# Altium schematic sheet battery.SchDoc
size A4
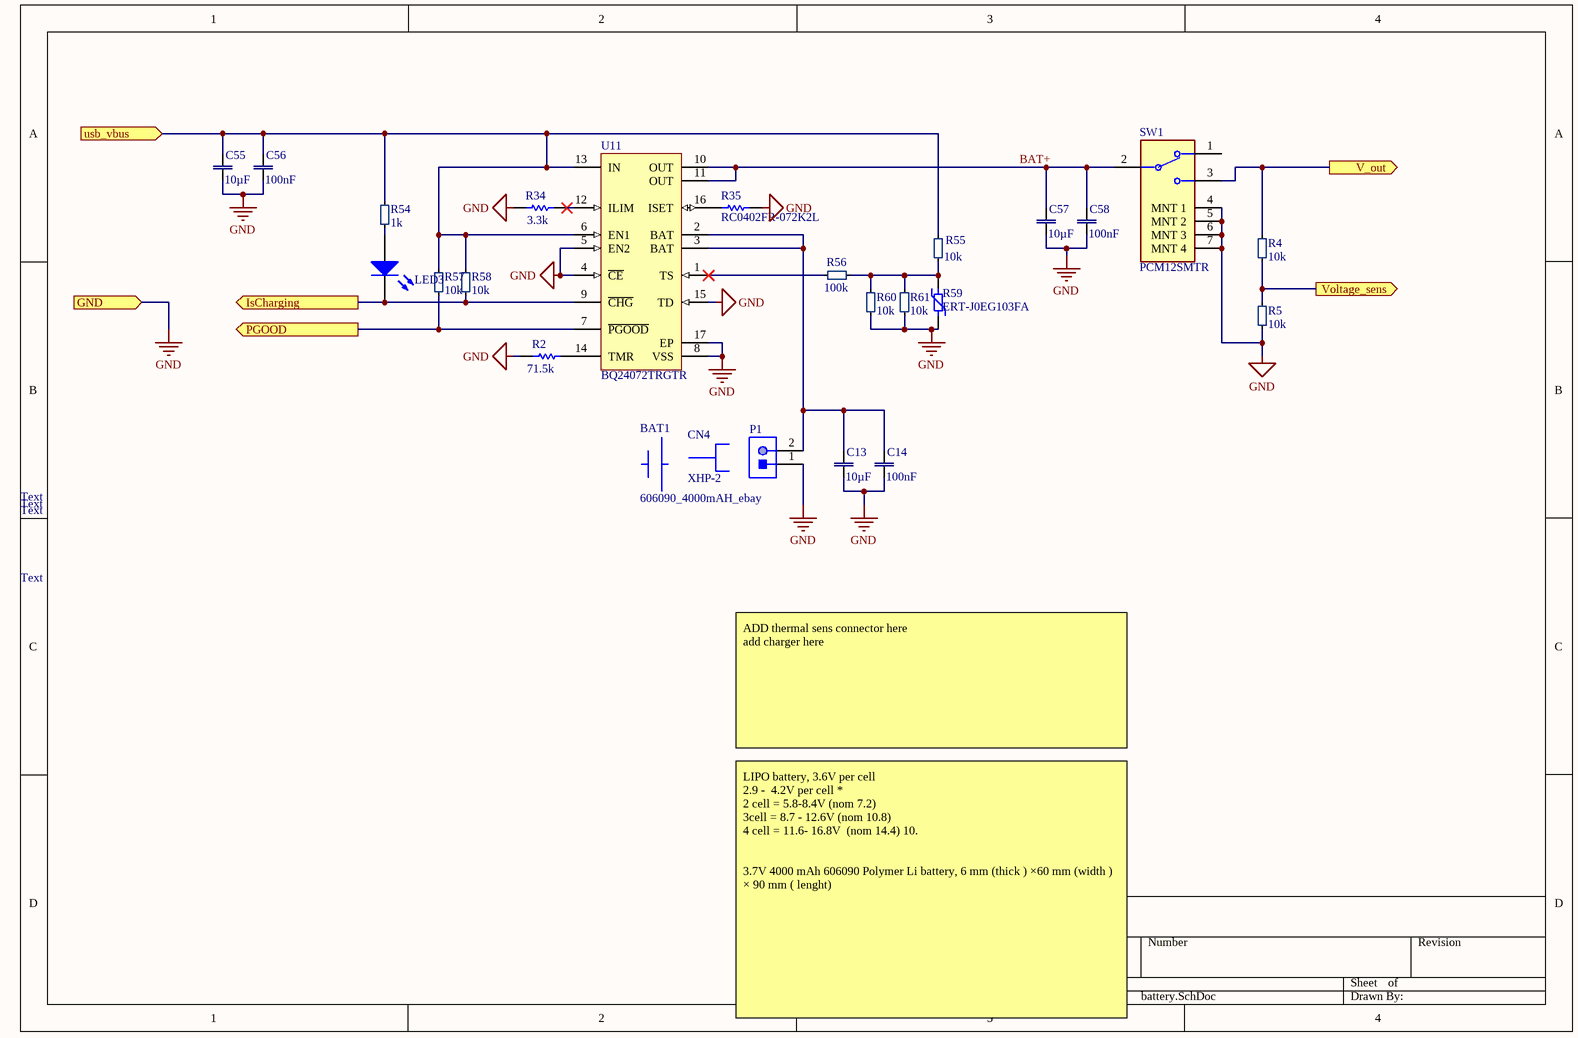
[diagram p0: battery.SchDoc]

## Parts
BAT1  606090_4000mAH_ebay  (mechanical)
C13  Capacitance: 10µF  [Chip2PinSM127P600-8N]  (hidden comment: CL31A106MBHNNNE)
C14  Capacitance: 100nF  [cap0402]  (hidden comment: GRM155R71H104ME14D)
C55  Capacitance: 10µF  [Chip2PinSM127P600-8N]  (hidden comment: CL31A106MBHNNNE)
C56  Capacitance: 100nF  [cap0402]  (hidden comment: GRM155R71H104ME14D)
C57  Capacitance: 10µF  [Chip2PinSM127P600-8N]  (hidden comment: CL31A106MBHNNNE)
C58  Capacitance: 100nF  [cap0402]  (hidden comment: GRM155R71H104ME14D)
CN4  XHP-2  (mechanical)
LED3  150080BS75000  [0805_A]  (value not drawn)
P1  S2B-XH-A(LF)(SN)  [JST-S2B-XH-A(LF)(SN)_V]  (value not drawn)
R2  Resistance: 71.5k  [RESC0402(1005)_N]  (hidden comment: RC0402FR-0771K5L)
R4  Resistance: 10k  [SMD_0402(1005)_M]  (hidden comment: RC0402FR-0710KL)
R5  Resistance: 10k  [SMD_0402(1005)_M]  (hidden comment: RC0402FR-0710KL)
R34  Resistance: 3.3k  [RESC1005X04N]  (hidden comment: RC0402FR-073K3L)
R35  RC0402FR-072K2L  [RESC1005X40X25NL05T10]
R54  Resistance: 1k  [SMD_0402(1005)_M]  (hidden comment: RC0402FR-071KL)
R55  Resistance: 10k  [SMD_0402(1005)_M]  (hidden comment: RC0402FR-0710KL)
R56  Resistance: 100k  [SMD_0402(1005)_M]  (hidden comment: RC0402FR-07100KL)
R57  Resistance: 10k  [SMD_0402(1005)_M]  (hidden comment: RC0402FR-0710KL)
R58  Resistance: 10k  [SMD_0402(1005)_M]  (hidden comment: RC0402FR-0710KL)
R59  ERT-J0EG103FA  [RESC0402(1005)_N]
R60  Resistance: 10k  [SMD_0402(1005)_M]  (hidden comment: RC0402FR-0710KL)
R61  Resistance: 10k  [SMD_0402(1005)_M]  (hidden comment: RC0402FR-0710KL)
SW1  PCM12SMTR  [FP-PCM12SMTR-MFG]
U11  BQ24072TRGTR  [RGT0016C_V]

## Ports
GND (in), IsCharging (out), PGOOD (out), usb_vbus (in), V_out (out), Voltage_sens (out)

## Nets
GND: C13.1 C14.1 C55.1 C56.1 C57.1 C58.1 P1.1 R2.1 R5.1 R34.1 R35.2 R59.1 R60.1 R61.1 SW1.4(MNT_1) SW1.5(MNT_2) SW1.6(MNT_3) SW1.7(MNT_4) U11.4(~{CE}) U11.5(EN2) U11.8(VSS) U11.15(TD) U11.17(EP) ; port GND
BAT+: C57.2 C58.2 SW1.2 U11.10(OUT) U11.11(OUT)
IsCharging: LED3.1(K) R58.1 U11.9(~{CHG}) ; port IsCharging
PGOOD: R57.1 U11.7(~{PGOOD}) ; port PGOOD
usb_vbus: C55.2 C56.2 R54.1 R55.2 R57.2 R58.2 U11.6(EN1) U11.13(IN) ; port usb_vbus
V_out: R4.2 SW1.3 ; port V_out
Voltage_sens: R4.1 R5.2 ; port Voltage_sens
NetC13_2: C13.2 C14.2 P1.2 U11.2(BAT) U11.3(BAT)
NetLED3_2: LED3.2(A) R54.2
NetR2_2: R2.2 U11.14(TMR)
NetR34_2: R34.2 U11.12(ILIM)
NetR35_1: R35.1 U11.16(ISET)
NetR55_1: R55.1 R56.2 R59.2 R60.2 R61.2
NetR56_1: R56.1 U11.1(TS)

Not connected (* = marked no-connect by the designer): SW1 1

## Notes on the sheet
- Text
- ADD thermal sens connector here
  add charger here
- LIPO battery, 3.6V per cell
  2.9 -  4.2V per cell *
  2 cell = 5.8-8.4V (nom 7.2)
  3cell = 8.7 - 12.6V (nom 10.8)
  4 cell = 11.6- 16.8V  (nom 14.4) 10.
  3.7V 4000 mAh 606090 Polymer Li battery, 6 mm (thick ) ×60 mm (width ) × 90 mm ( lenght)

## Library data of the parts
BAT1 = CMP-ROOT-00019-6: https://www.ebay.com/itm/3-7V-4000-mAh-606090-Polymer-Li-battery-Li-po-For-PDA-GPS-DVD-ipod-Tablet-PC/182107148013; Voltage: 3.7V; Mount: connector; RoHS: Yes; Capacity: 4000mAh; ComponentLink1URL: https://www.ebay.com/itm/3-7V-4000-mAh-606090-Polymer-Li-battery-Li-po-For-PDA-GPS-DVD-ipod-Tablet-PC/182107148013; ComponentLink1Description: EBAY; Type: lipo; Case/Package: 606090
C13 C55 C57 = CMP-0001-00015-3: CAP CER 10UF 50V X5R 1206; Capacitor Type: Ceramic; Tolerance: 20%; Thickness: 0.071inch; Mount: Surface Mount; Dielectric: X5R; Length: 0.126inch; Case/Package: 1206; Width: 0.063inch; Voltage Rating (DC): 50V; Max Operating Temperature: 85°C; Case Code (Imperial): 1206; Voltage Rating: 50V; Min Operating Temperature: -55°C; Packaging: Tape and Reel; Case Code (Metric): 3216; RoHS: Yes
C14 C56 C58 = CMP-0001-00001-8: 0402 0.1 uF 50 V ±20% Tolerance X7R SMT Monolithic Ceramic Chip Capacitor; Value: 100nF; Voltage Rating: 50V; Length: 0.039inch; Packaging: Cut Tape; Max Operating Temperature: 125°C; Min Operating Temperature: -55°C; Mount: Surface Mount; Case/Package: 0402; Tolerance: 20%; Width: 0.02inch; Capacitor Type: Ceramic; Thickness: 0.022inch; Pins: 2; RoHS: Yes
CN4 = CMP-ROOT-00022-2: Conn Housing PL 2 POS 2.5mm Crimp ST Cable Mount Bag; Max Voltage Rating (AC): 250V; Wire/Cable Gauge: 22AWG; Max Current Rating: 3A; Gender: Receptacle; Number of Contacts: 2; System: Connector; Contact Resistance: 10mR; Wire Gauge (Max): 30AWG; Insulation Resistance: 1GR; Connector Type: Receptacle,Socket; Mount: Free Hanging,Cable; Height: 0.25inch; Weight: 0.0625lb; Current Rating: 3A; Max Voltage Rating (DC): 250V; Packaging: Bag; REACH SVHC: No SVHC; Lead Pitch: 2.5mm; Width: 5.7mm; Color: Natural; Length: 7.3mm; Housing Material: Polyamide; Number of Rows: 1; Max Operating Temperature: 85°C; Lead Free: Lead Free; Termination: Crimp; Housing Color: White; Depth: 7.75mm; Voltage Rating (AC): 250V; Min Operating Temperature: -25°C; Wire Gauge (Min): 22AWG; Orientation: Straight; Number of Positions: 2; RoHS: Yes; Contact Material: Bronze,Tin; Pitch: 2.5mm
LED3 = CMP-00002-1: SMD LED blue 3.5 V 0805, 150080BS75000, Würth Elektronik; Dominant Wavelength: 470nm; Luminous Intensity: 145mcd; Lens Style: Clear,Rectangular; Forward Current: 30mA; Test Current: 20mA; Forward Voltage: 3.2V; Viewing Angle: 140°; Length: 2mm; Width: 1.25mm; RoHS: Yes; Height: 0.7mm; Color: Blue; Packaging: Tape and Reel; REACH SVHC: Unknown; Max Operating Temperature: 85°C; Case Code (Imperial): 0805; Lead Free: Lead Free; Case Code (Metric): 2012; Case/Package: 0805; Min Operating Temperature: -40°C; Wavelength: 470nm; Package Quantity: 4000; Mount: Surface Mount
P1 = CMP-ROOT-00028-1: XH Series 2.5mm 2 Position Through Hole Shrouded Header Connector; Number of Positions: 2; RoHS: Yes; System: Connector; Mount: Through Hole
R2 = CMP-001-0022-2: RES SMD 71.5K OHM 1% 1/16W 0402; Temperature Coefficient: 100ppm/°C; Voltage Rating: 50V; Max Power Dissipation: 63mW; Power Rating: 62.5mW; Military Standard: Not; Width: 0.02inch; Packaging: Tape and Reel; Case/Package: 0402; Lead Free: Lead Free; Depth: 0.5mm; Termination: SMD/SMT; Value: 71.5k; Number of Terminations: 2; RoHS: Yes; Resistor Type: Thick Film; Length: 0.039inch; Min Operating Temperature: -55°C; Case Code (Metric): 1005; Tolerance: 1%; Mount: SMD; Case Code (Imperial): 0402; Max Operating Temperature: 155°C; Voltage Rating (DC): 50V; Height: 0.016inch; Features: Moisture Resistant
R4 R5 R55 R57 R58 R60 R61 = CMP-008-0005-9: Surface Mount Thick Film Resistor, Rc Series, 10 Kohm, 62.5 Mw, - 1%, 50 V, 0402 [1005 Metric]; Voltage Rating (DC): 50V; Value: 10k; Temperature Coefficient: 100ppm/°C; Power Rating: 62.5mW; Lead Pitch: 0.2mm; Composition: Thick Film; Number of Terminations: 2; Number of Pins: 2; Military Standard: Not; Working Voltage: 50V; Length: 1mm; Packaging: Tape and Reel; Height: 0.32mm; Voltage Rating: 50V; Mount: SMD; Tolerance: 1%; Termination: SMD/SMT; Depth: 0.5mm; Min Operating Temperature: -55°C; RoHS: Yes; Case Code (Metric): 1005; Case Code (Imperial): 0402; Lead Free: Lead Free; Width: 0.5mm; Case/Package: 0402; REACH SVHC: No SVHC; Max Operating Temperature: 155°C
R34 = CMP-001-0021-2: YAGEO (PHYCOMP)         RC0402FR-073K3L             SMD Chip Resistor, Thick Film, 3.3 kohm, 50 V, 0402 [1005 Metric], 63 mW,  1%; Voltage Rating (DC): 50V; Value: 3.3k; Temperature Coefficient: 100ppm/°C; Power Rating: 62.5mW; Max Power Dissipation: 63mW; Packaging: Tape and Reel; Width: 0.5mm; Number of Pins: 2; Height: 0.016inch; Case Code (Imperial): 0402; Case/Package: 0402; Length: 1mm; Tolerance: 1%; Termination: SMD/SMT; Military Standard: Not; RoHS: Yes; Case Code (Metric): 1005; Depth: 0.5mm; Lead Free: Lead Free; Mount: SMD; REACH SVHC: No SVHC; Features: Moisture Resistant; Number of Terminations: 2; Package Quantity: 1; Min Operating Temperature: -55°C; Resistor Type: Thick Film; Max Operating Temperature: 155°C; Voltage Rating: 50V
R35 = CMP-001-0020-3: RES SMD 2.2K OHM 1% 1/16W 0402; Power Rating: 63mW; Voltage Rating: 50V; Temperature Coefficient: 100ppm/°C; Termination: SMD/SMT; Height: 0.35mm; Width: 0.5mm; Length: 1mm; Composition: Thick Film; Weight: 2.3E-05oz; RoHS: Yes; Max Operating Temperature: 155°C; Mount: SMD; Military Standard: Not; Case Code (Metric): 1005; Depth: 0.5mm; Tolerance: 1%; Min Operating Temperature: -55°C; Packaging: Tape and Reel; REACH SVHC: Unknown; Resistance: 2.2k; Case/Package: 0402; Case Code (Imperial): 0402; Value: 2.2k; Lead Free: Lead Free
R54 = CMP-001-0000-7: Surface Mount Chip Resistor, Thick Film, RC Series, 1 kohm, 62.5 mW, 1%, 50 V, 0402 [1005 Metric]; Temperature Coefficient: 100ppm/°C; Value: 1k; Voltage Rating: 50V; Power Rating: 62.5mW; RoHS: Yes; Max Operating Temperature: 155°C; Width: 0.5mm; Case Code (Metric): 1005; Mount: SMD; Min Operating Temperature: -55°C; Lead Free: Lead Free; Military Standard: Not; Case Code (Imperial): 0402; Number of Pins: 2; Height: 0.32mm; Case/Package: 0402; Composition: Thick Film; Packaging: Tape and Reel; Length: 1mm; Tolerance: 1%; Depth: 0.5mm; Voltage Rating (DC): 50V; Termination: SMD/SMT; REACH SVHC: Unknown
R56 = CMP-0001-00006-4: Res General Purpose Thick Film 0402 100K Ohm 1% 1/16W ±100ppm/°C Molded SMD Paper T/R; Max Power Dissipation: 63mW; Voltage Rating: 50V; Value: 100k; Termination: SMD/SMT; Tolerance: 1%; Length: 0.039inch; REACH SVHC: No SVHC; Features: Moisture Resistant; Mount: SMD; Power Rating: 63mW; Depth: 0.5mm; Max Operating Temperature: 155°C; Width: 0.02inch; Height: 0.016inch; Case Code (Metric): 1005; Temperature Coefficient: 100ppm/°C; Military Standard: Not; Case/Package: 0402; Lead Free: Lead Free; Working Voltage: 50V; Package Quantity: 1; Number of Terminations: 2; Min Operating Temperature: -55°C; Composition: Thick Film; RoHS: Yes; Packaging: Tape and Reel; Case Code (Imperial): 0402
R59 = CMP-0001-00021-3: PANASONIC ELECTRONIC COMPONENTS         ERTJ0EG103FA             THERMISTOR, NTC, 0402, 10K; Tolerance: 1%; Power Rating: 66mW; Package Quantity: 1; Max Operating Temperature: 125°C; Contact Plating: Tin; Termination: SMD/SMT; Height: 0.5mm; Resistance: 10k; Number of Pins: 2; Width: 500um; Case/Package: 0402; REACH SVHC: No SVHC; Length: 1mm; Lead Free: Lead Free; Case Code (Metric): 1005; Case Code (Imperial): 0402; Min Operating Temperature: -40°C; RoHS: Yes; Max Power Dissipation: 66mW; Mount: Surface Mount; Accuracy: 1%; Packaging: Tape and Reel; Depth: 0.5mm; Radiation Hardening: No
SW1 = CMP-ROOT-00026-3: C & K COMPONENTS - PCM12SMTR - SWITCH, SPDT, 0.3A, 6VDC, SMD; Contact Current Rating: 300mA; Switch Function: On-On; Voltage Rating (DC): 6V; Actuator Type: Standard; Insulation Resistance: 100mR; Contact Resistance: 70mR; Switch Travel: 1.5mm; Actuator Material: Nylon,Polyamide,PA46; Mechanical Life: 10000Cycles; Lead Free: Lead Free; Throw Configuration: SPDT; Width: 6.7mm; Package Quantity: 1; Case/Package: smd; REACH SVHC: No SVHC; Series: PCM; Termination: Gull Wing; Contact Material: Copper Alloy,Copper,Silver; Min Operating Temperature: -20°C; Length: 7.7mm; Max Current Rating: 300mA; Orientation: Right Angle; Current Rating: 300mA; Voltage Rating (AC): 6V; Max Operating Temperature: 85°C; Mount: Surface Mount; Depth: 5mm; Packaging: Tape and Reel; Max Voltage Rating (DC): 6V; Actuator Length: 1.5mm; Contact Plating: Silver; RoHS: Yes
U11 = CMP-00007-3: IC LI-ION CHARGE MGMT 16QFN; Max Supply Voltage: 6.4V; Number of Cells: 1; Min Supply Voltage: 4.35V; Output Current: 1.5A; Output Voltage: 4.2V; Min Input Voltage: 4.3V; Min Operating Temperature: -40°C; Package Quantity: 1; Radiation Hardening: No; Max Operating Temperature: 85°C; Case/Package: VQFN EP; Number of Pins: 16; Packaging: Tape and Reel; Contact Plating: Gold; Lead Free: Lead Free